# EAGLE design in_out_mcp23017 (EAGLE 7.6.0)
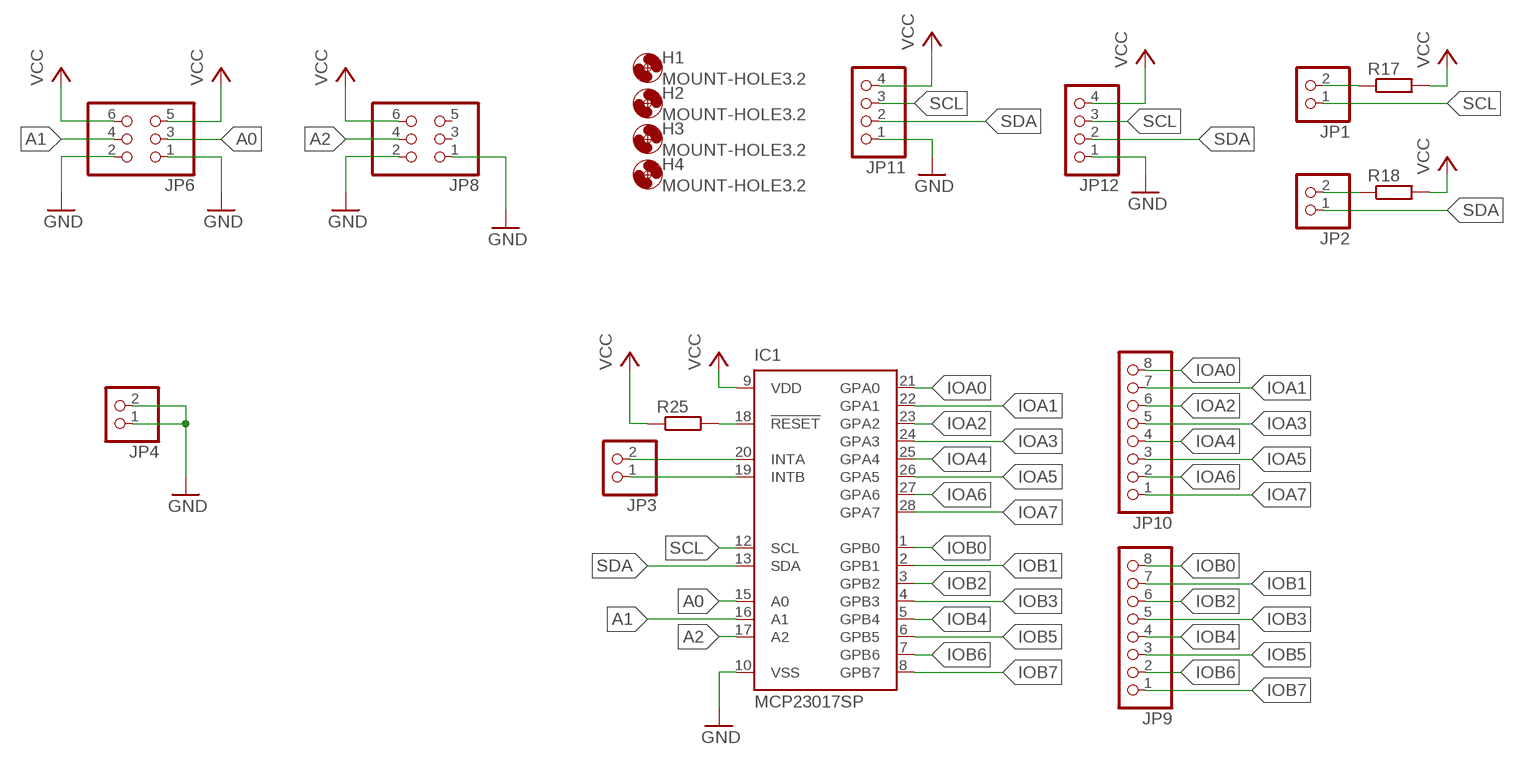
[diagram p0: schematic, sheet 1]

## Parts
H1  MOUNT-HOLE3.2  [3,2]
H2  MOUNT-HOLE3.2  [3,2]
H3  MOUNT-HOLE3.2  [3,2]
H4  MOUNT-HOLE3.2  [3,2]
IC1  MCP23017SP  [DIL28-3]
JP1  PINHD-1X2  [1X02]
JP2  PINHD-1X2  [1X02]
JP3  PINHD-1X2  [1X02]
JP4  PINHD-1X2  [1X02]
JP6  PINHD-2X3  [2X03]
JP8  PINHD-2X3  [2X03]
JP9  PINHD-1X8  [1X08]
JP10  PINHD-1X8  [1X08]
JP11  PINHD-1X4  [1X04]
JP12  PINHD-1X4  [1X04]
R17  R-EU_0207/10  [0207/10]
R18  R-EU_0207/10  [0207/10]
R25  R-EU_0207/10  [0207/10]

## Nets
A0: IC1.15(A0) JP6.3
A1: IC1.16(A1) JP6.4
A2: IC1.17(A2) JP8.4
GND: IC1.10(VSS) JP4.1 JP4.2 JP6.1 JP6.2 JP8.1 JP8.2 JP11.1 JP12.1
IOA0: IC1.21(GPA0) JP10.8
IOA1: IC1.22(GPA1) JP10.7
IOA2: IC1.23(GPA2) JP10.6
IOA3: IC1.24(GPA3) JP10.5
IOA4: IC1.25(GPA4) JP10.4
IOA5: IC1.26(GPA5) JP10.3
IOA6: IC1.27(GPA6) JP10.2
IOA7: IC1.28(GPA7) JP10.1
IOB0: IC1.1(GPB0) JP9.8
IOB1: IC1.2(GPB1) JP9.7
IOB2: IC1.3(GPB2) JP9.6
IOB3: IC1.4(GPB3) JP9.5
IOB4: IC1.5(GPB4) JP9.4
IOB5: IC1.6(GPB5) JP9.3
IOB6: IC1.7(GPB6) JP9.2
IOB7: IC1.8(GPB7) JP9.1
N$2: IC1.18(!RESET) R25.2
N$3: JP2.2 R18.1
N$4: JP1.2 R17.1
N$6: IC1.20(INTA) JP3.2
N$8: IC1.19(INTB) JP3.1
SCL: IC1.12(SCL) JP1.1 JP11.3 JP12.3
SDA: IC1.13(SDA) JP2.1 JP11.2 JP12.2
VCC: IC1.9(VDD) JP6.5 JP6.6 JP8.6 JP11.4 JP12.4 R17.2 R18.2 R25.1
Unconnected: JP8.3 JP8.5

## Library data of the parts
H1-H4 = holes:MOUNT-HOLE: MOUNTING HOLE with drill center marker
IC1 = adafruit:MCP23017: http://ww1.microchip.com/downloads/en/DeviceDoc/21952a.pdf Source: http://ww1.microchip.com/downloads/en/DeviceDoc/21952a.pdf
JP1-JP4 = pinhead:PINHD-1X2: PIN HEADER
JP6 JP8 = pinhead:PINHD-2X3: PIN HEADER
JP9 JP10 = pinhead:PINHD-1X8: PIN HEADER
JP11 JP12 = pinhead:PINHD-1X4: PIN HEADER
R17 R18 R25 = rcl:R-EU_: RESISTOR, European symbol

## Board
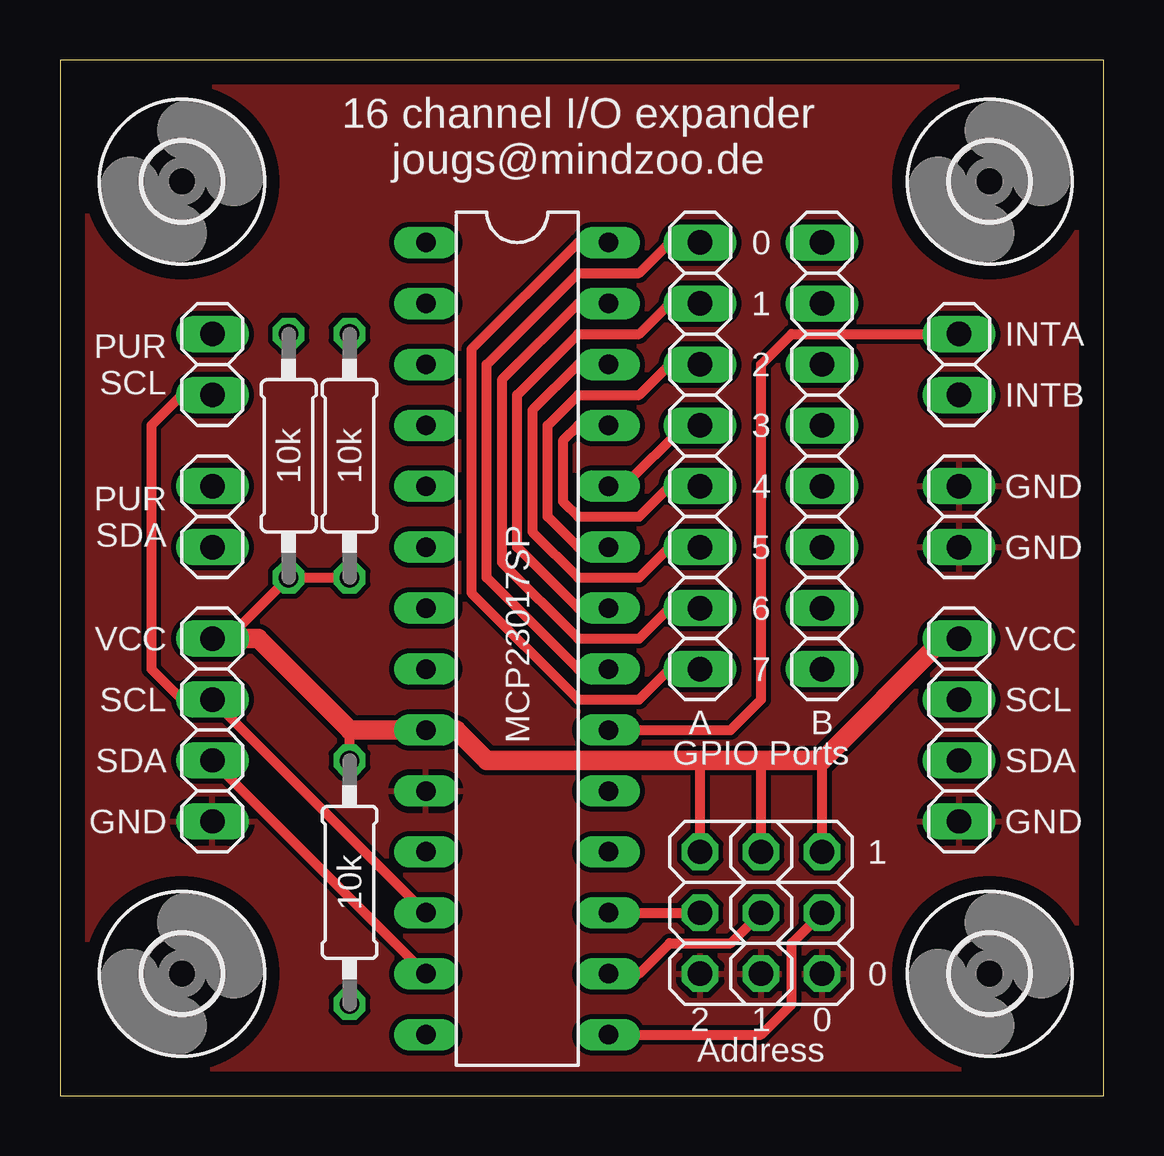
[diagram p1: board, top side]
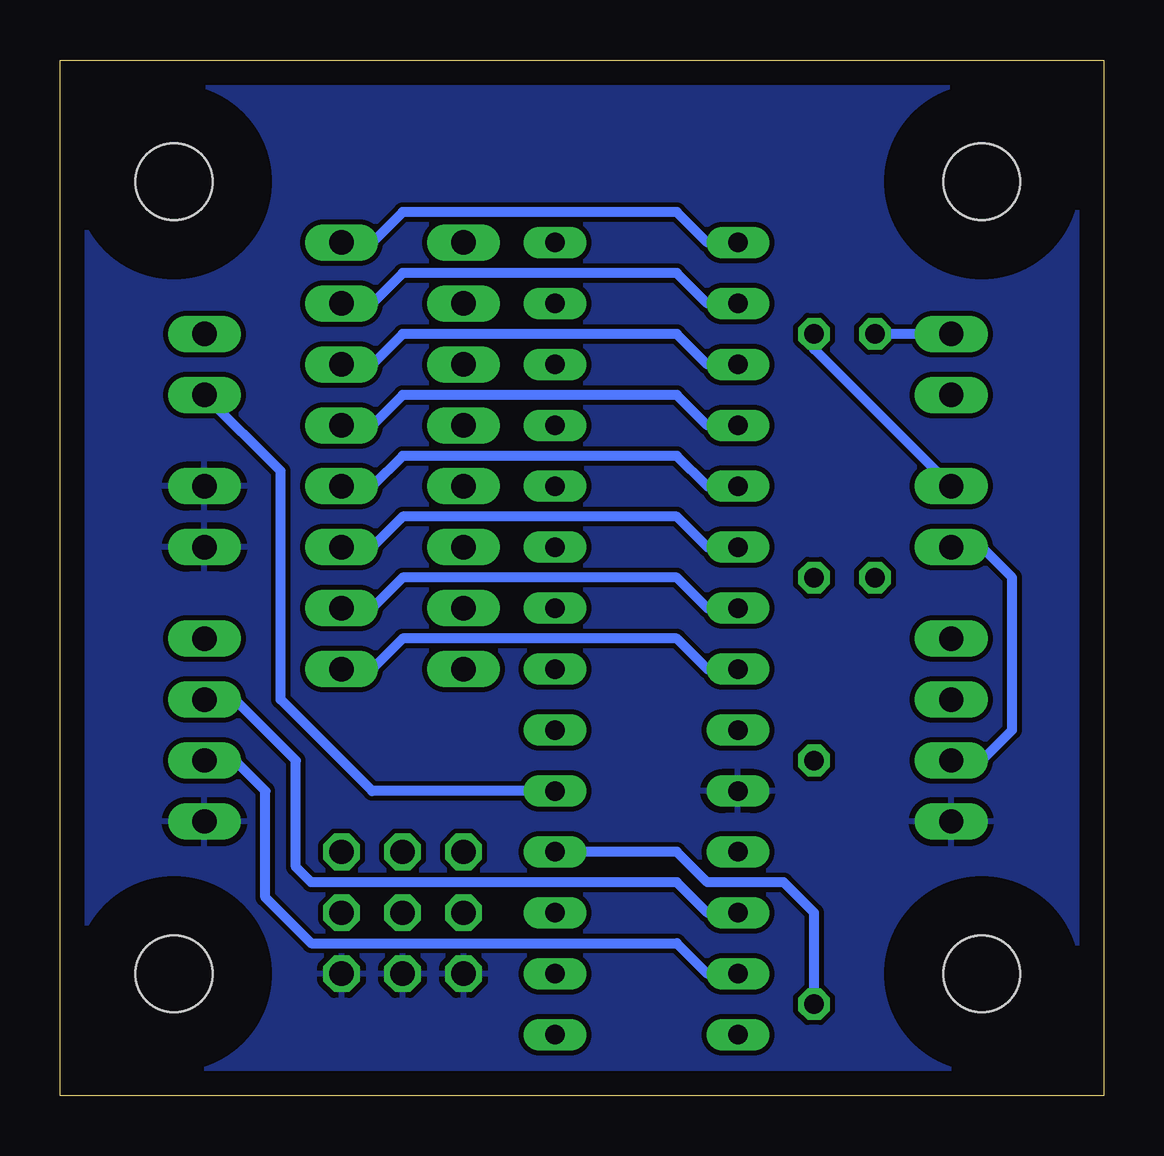
[diagram p2: board, bottom side, seen from below]

Size 43.48 x 43.17 mm. Coordinates in mm from the lower left corner, seen from the top.
Outline: 0,0 43.48,0 43.48,43.17 0,43.17 0,0
Copper layers (1*16): Top 0.035mm / dielectric 1.5mm / Bottom 0.035mm
Design rules "default": minimum track width 10mil, minimum drill 24mil, track to track 8mil, track to pad 8mil, pad to pad 8mil, via to via 8mil, smd to smd 8mil, copper to edge 40mil, drill to drill 8mil, minimum pad ring 10mil, minimum via ring 8mil, stop-mask expansion 4mil, vias tented up to drill 0mil, thermal gap 10mil

### Footprints (pad centres in the part's own frame; a part is rotated, then mirrored left to right if it is on the bottom)
3,2 = hole 3.2: 0,0
DIL28-3 = drill 0.813 long: 1 -16.51,-3.81; 2 -13.97,-3.81; 3 -11.43,-3.81; 4 -8.89,-3.81; 5 -6.35,-3.81; 6 -3.81,-3.81; 7 -1.27,-3.81; 8 1.27,-3.81; 9 3.81,-3.81; 10 6.35,-3.81; 11 8.89,-3.81; 12 11.43,-3.81; 13 13.97,-3.81; 14 16.51,-3.81; 15 16.51,3.81; 16 13.97,3.81; 17 11.43,3.81; 18 8.89,3.81; 19 6.35,3.81; 20 3.81,3.81; 21 1.27,3.81; 22 -1.27,3.81; 23 -3.81,3.81; 24 -6.35,3.81; 25 -8.89,3.81; 26 -11.43,3.81; 27 -13.97,3.81; 28 -16.51,3.81
1X02 = drill 1.016 long: 1 -1.27,0; 2 1.27,0
2X03 = drill 1.016 octagon: 1 -2.54,-1.27; 2 -2.54,1.27; 3 0,-1.27; 4 0,1.27; 5 2.54,-1.27; 6 2.54,1.27
1X08 = drill 1.016 long: 1 -8.89,0; 2 -6.35,0; 3 -3.81,0; 4 -1.27,0; 5 1.27,0; 6 3.81,0; 7 6.35,0; 8 8.89,0
1X04 = drill 1.016 long: 1 -3.81,0; 2 -1.27,0; 3 1.27,0; 4 3.81,0
0207/10 = drill 0.813 octagon: 1 -5.08,0; 2 5.08,0

### Placement (x,y rotation side)
H1  38.73,38.1 0 top
H2  38.73,5.08 0 top
H3  5.08,38.1 0 top
H4  5.08,5.08 0 top
IC1  19.05,19.05 270 top
JP1  6.35,30.48 90 top
JP2  6.35,24.13 90 top
JP3  37.47,30.48 90 top
JP4  37.47,24.13 270 top
JP6  30.48,7.62 90 top
JP8  27.94,7.62 90 top
JP9  31.75,26.67 90 top
JP10  26.67,26.67 90 top
JP11  6.35,15.24 90 top
JP12  37.47,15.24 90 top
R17  9.53,26.67 270 top
R18  12.06,26.67 270 top
R25  12.06,8.89 270 top

### Tracks (layer width: path | path; a pad name or v marks a point on that pad's centre or on a via)
A0
  Top 0.406: IC1.15 29.21,2.54 30.48,3.81 30.48,6.35 JP6.3
A1
  Top 0.406: IC1.16 24.13,5.08 25.4,6.35 27.94,6.35 JP6.4
A2
  Top 0.406: IC1.17 JP8.4
GND
  pour Bottom: -5.08,43.18 43.81,43.18 43.81,-0.64 0,0
  pour Top: 0,43.18 0,0 43.81,0 50.16,43.18
IOA0
  Top 0.406: IC1.21 21.59,17.78 17.78,21.59 17.78,30.48 21.59,34.29 24.13,34.29 25.4,35.56 JP10.8
IOA1
  Top 0.406: IC1.22 21.59,20.32 19.05,22.86 19.05,29.21 21.59,31.75 24.13,31.75 25.4,33.02 JP10.7
IOA2
  Top 0.406: IC1.23 21.59,22.86 20.32,24.13 20.32,27.94 21.59,29.21 24.13,29.21 25.4,30.48 JP10.6
IOA3
  Top 0.406: IC1.24 23.5,25.4 26.04,27.94 JP10.5
IOA4
  Top 0.406: IC1.25 21.59,27.94 20.95,27.3 20.95,24.77 21.59,24.13 24.13,24.13 25.4,25.4 JP10.4
IOA5
  Top 0.406: IC1.26 21.59,30.48 19.68,28.57 19.68,23.5 21.59,21.59 24.13,21.59 25.4,22.86 JP10.3
IOA6
  Top 0.406: IC1.27 21.59,33.02 18.41,29.84 18.41,22.23 21.59,19.05 24.13,19.05 25.4,20.32 JP10.2
IOA7
  Top 0.406: IC1.28 21.59,35.56 17.14,31.11 17.14,20.95 21.59,16.51 24.13,16.51 25.4,17.78 JP10.1
IOB0
  Bottom 0.406: IC1.1 16.51,35.56 17.78,36.83 29.21,36.83 30.48,35.56 JP9.8
IOB1
  Bottom 0.406: IC1.2 16.51,33.02 17.78,34.29 29.21,34.29 30.48,33.02 JP9.7
IOB2
  Bottom 0.406: IC1.3 16.51,30.48 17.78,31.75 29.21,31.75 30.48,30.48 JP9.6
IOB3
  Bottom 0.406: IC1.4 16.51,27.94 17.78,29.21 29.21,29.21 30.48,27.94 JP9.5
IOB4
  Bottom 0.406: IC1.5 16.51,25.4 17.78,26.67 29.21,26.67 30.48,25.4 JP9.4
IOB5
  Bottom 0.406: IC1.6 16.51,22.86 17.78,24.13 29.21,24.13 30.48,22.86 JP9.3
IOB6
  Bottom 0.406: IC1.7 16.51,20.32 17.78,21.59 29.21,21.59 30.48,20.32 JP9.2
IOB7
  Bottom 0.406: IC1.8 16.51,17.78 17.78,19.05 29.21,19.05 30.48,17.78 JP9.1
N$2
  Bottom 0.406: R25.2 12.06,7.62 13.34,8.89 16.51,8.89 17.78,10.16 IC1.18
N$3
  Bottom 0.406: JP2.2 12.06,31.11 R18.1
N$4
  Bottom 0.406: JP1.2 R17.1
N$6
  Top 0.406: IC1.20 27.94,15.24 29.21,16.51 29.21,30.48 30.48,31.75 JP3.2
N$8
  Bottom 0.406: IC1.19 30.48,12.7 34.29,16.51 34.29,26.04 JP3.1
SCL
  Top 0.406: JP1.1 5.08,29.21 3.81,27.94 3.81,17.78 5.08,16.51 JP11.3 IC1.12
  Bottom 0.406: IC1.12 16.51,7.62 17.78,8.89 33.02,8.89 33.66,9.53 33.66,13.97 36.2,16.51 JP12.3
SDA
  Top 0.406: JP11.2 IC1.13
  Bottom 0.406: JP11.2 5.08,13.97 3.81,15.24 3.81,21.59 5.08,22.86 JP2.1 | IC1.13 16.51,5.08 17.78,6.35 33.02,6.35 34.92,8.26 34.92,12.7 36.2,13.97 JP12.2
VCC
  Top 0.406: JP8.6 26.67,13.97 | JP6.6 29.21,13.97 | JP6.5 31.75,13.97 | R18.2 R17.2 6.99,19.05 JP11.4 | R25.1 12.06,15.24
  Top 0.813: JP12.4 36.83,19.05 31.75,13.97 29.21,13.97 26.67,13.97 17.78,13.97 16.51,15.24 IC1.9 12.06,15.24 8.26,19.05 JP11.4

### Text on the board
tNames: 16 channel I/O expander / jougs@mindzoo.de | 0 | 1 | INTA | PUR / SCL | 2 | INTB | 3 | 10k | 10k | 4 | GND | PUR / SDA | 5 | GND | 6 | VCC | VCC | 7 | SCL | SCL | A | B | SDA | GPIO Ports | SDA | GND | GND | 1 | 10k | 0 | 2 | 1 | 0 | Address